# EAGLE board BPM (EAGLE 8.1.0)
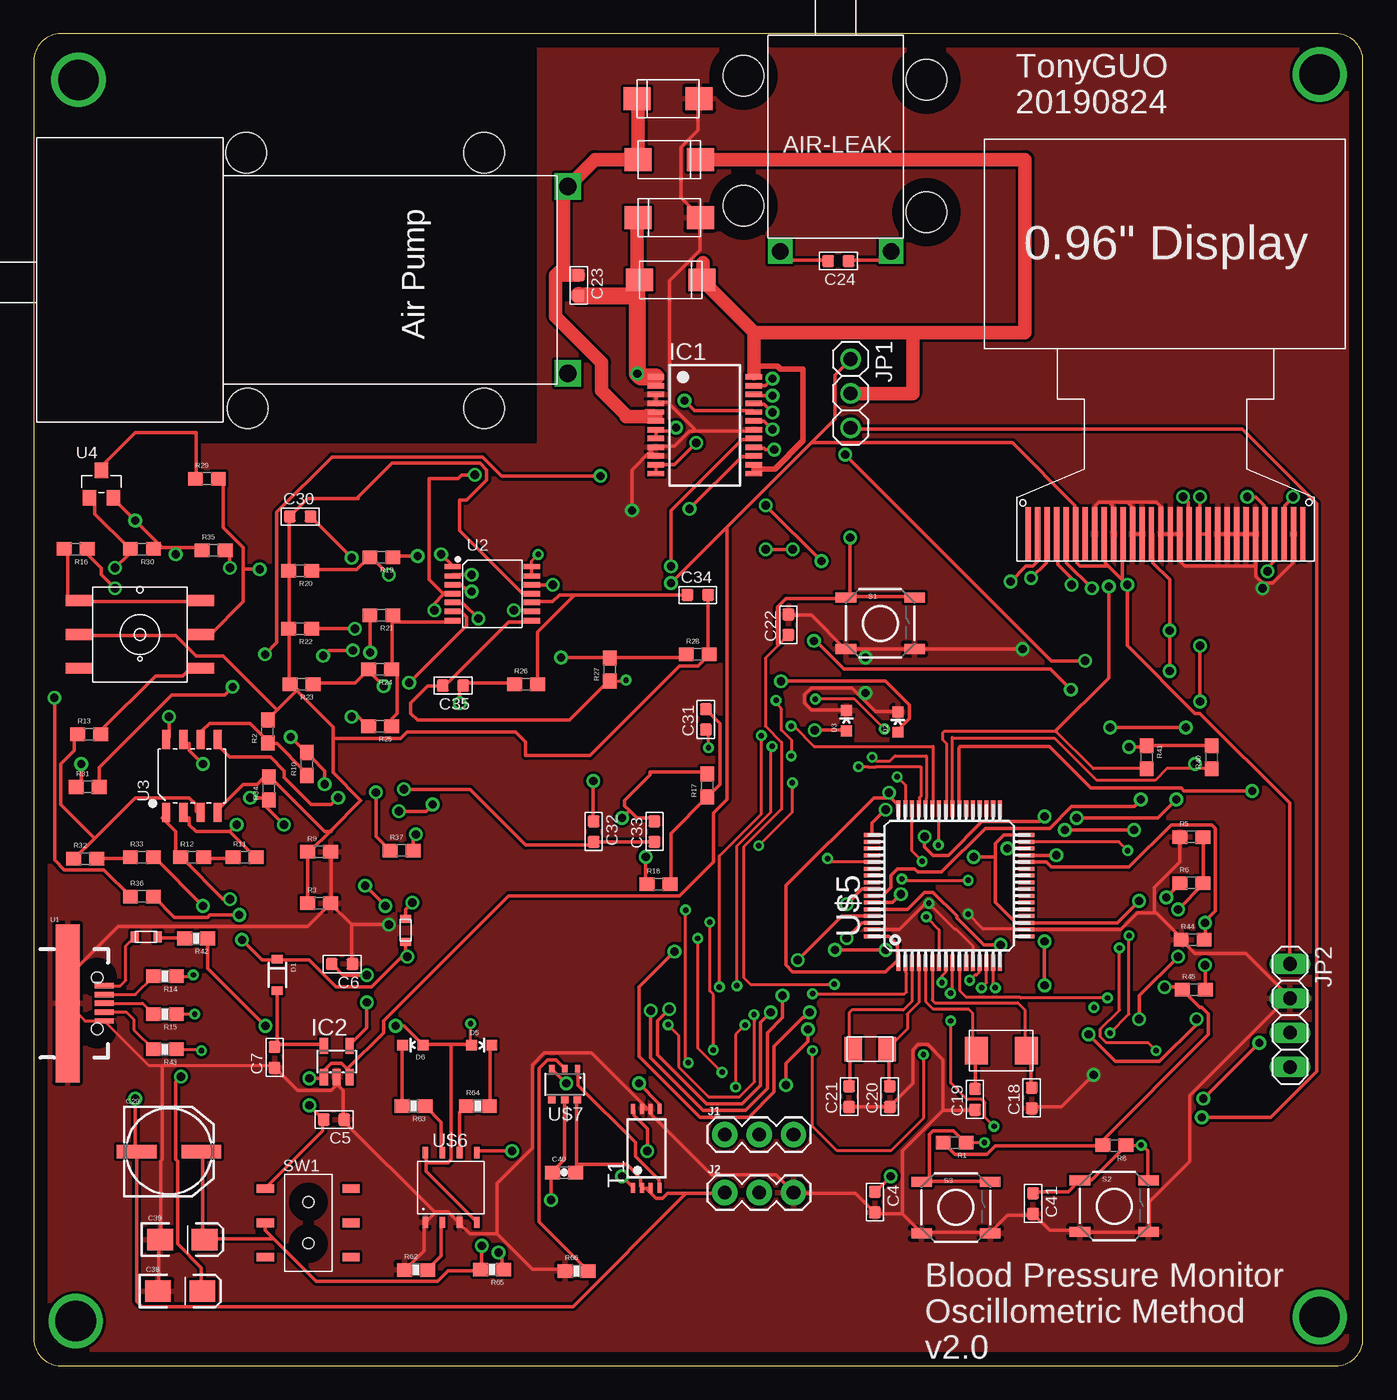
[diagram p5: board, top side]
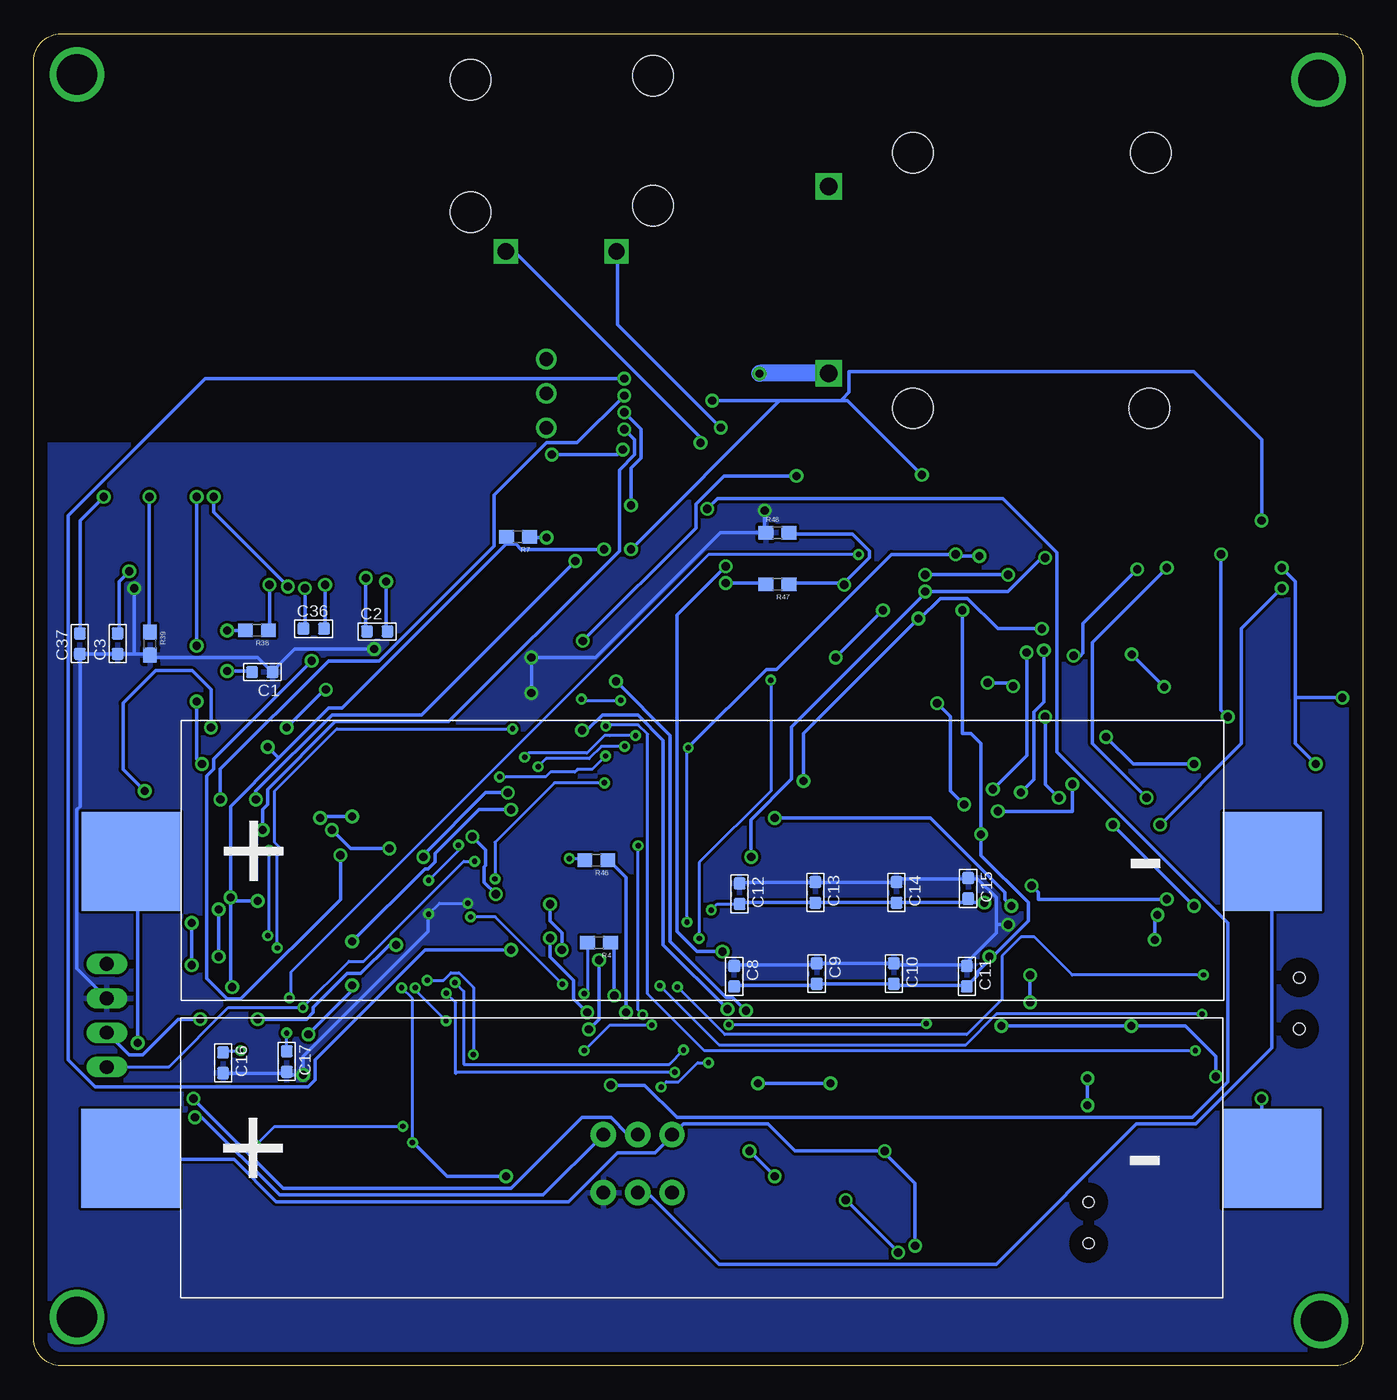
[diagram p6: board, bottom side, seen from below]

Size 98.3 x 98.5 mm. Coordinates in mm from the lower left corner, seen from the top.
Outline: 0,96.5 0,2 arc90 2,0 96.3,0 arc90 98.3,2 98.3,96.5 arc90 96.3,98.5 2,98.5 arc90 0,96.5
Copper layers (1*16): Top 0.035mm / dielectric 1.5mm / Bottom 0.035mm
Design rules "default": minimum track width 10mil, minimum drill 24mil, track to track 8mil, track to pad 8mil, pad to pad 8mil, via to via 8mil, smd to smd 8mil, copper to edge 40mil, drill to drill 8mil, minimum pad ring 10mil, minimum via ring 8mil, stop-mask expansion 4mil, vias tented up to drill 0mil, thermal gap 10mil

## Footprints (pad centres in the part's own frame; a part is rotated, then mirrored left to right if it is on the bottom)
C0603 = smd 0.889 x 0.889: 1 0,0.762; 2 0,-0.762
NIPPON_F80 = smd 2.95 x 1: + 2.4,0; - -2.4,0
EIA3216-KIT = smd 1.9 x 1.6: A 1.65,0; C -1.65,0
0603-CAP = smd 1.1 x 1: 1 -0.85,0; 2 0.85,0
SOD-323 = smd 0.63 x 0.83: 1 -1.15,0; 2 1.15,0
LED-0603 = smd 0.8 x 0.8: A 0,-0.75; C 0,0.75
SSOP24 = smd 0.4 x 1.25: 1 -3.575,-3.625; 2 -2.925,-3.625; 3 -2.275,-3.625; 4 -1.625,-3.625; 5 -0.975,-3.625; 6 -0.325,-3.625; 7 0.325,-3.625; 8 0.975,-3.625; 9 1.625,-3.625; 10 2.275,-3.625; 11 2.925,-3.625; 12 3.575,-3.625; 13 3.575,3.625; 14 2.925,3.625; 15 2.275,3.625; 16 1.625,3.625; 17 0.975,3.625; 18 0.325,3.625; 19 -0.325,3.625; 20 -0.975,3.625; 21 -1.625,3.625; 22 -2.275,3.625; 23 -2.925,3.625; 24 -3.575,3.625
SOT23-5L = smd 0.6 x 1.2: 1 -0.95,-1.15; 2 0,-1.15; 3 0.95,-1.15; 4 0.95,1.15; 5 -0.95,1.15
1X03 = drill 1.016 pad 1.88: 1 0,0; 2 2.54,0; 3 5.08,0
1X03' = drill 1.016: 1 -2.54,0; 2 0,0; 3 2.54,0
1X04 = drill 1.016 long: 1 -3.81,0; 2 -1.27,0; 3 1.27,0; 4 3.81,0
0603 = smd 1.1 x 1: 1 -0.85,0; 2 0.85,0
0603-RES = smd 1.1 x 1: 1 -0.85,0; 2 0.85,0
TACTILE_SWITCH_SMD = smd 1.524 x 0.762: 1 -2.54,1.905; 2 2.54,1.905; 3 -2.54,-1.905; 4 2.54,-1.905
SW6-2.54-SMD-7.0X3.5X1.5MM = smd 1.27 x 0.635: CH1A -3.175,2.54; CH1B -3.175,-2.54; CH2A 3.175,2.54; CH2B 3.175,-2.54; COM1 -3.175,0; COM2 3.175,0 | hole 0.813: 0,1.524; 0,-1.524
TSSOP-8 = smd 0.3 x 0.75: 1 -0.975,-2.925; 2 -0.325,-2.925; 3 0.325,-2.925; 4 0.975,-2.925; 5 0.975,2.925; 6 0.325,2.925; 7 -0.325,2.925; 8 -0.975,2.925
USB-MICRO-SMD = smd 1.4 x 0.4: D+1 2.7,0; D-1 2.7,0.65; GND1 2.7,-1.3; ID1 2.7,-0.65; VBUS1 2.7,1.3 | smd 1.778 x 11.684: GND 0,0 | hole 0.85: 2.2,1.9; 2.2,-1.9
TSSOP14-0.65-5X4.4MM = smd 0.4 x 1.2: 1 -2,-2.925; 2 -1.3,-2.925; 3 -0.65,-2.925; 4 0,-2.925; 5 0.65,-2.925; 6 1.3,-2.925; 7 2,-2.925; 8 2,2.925; 9 1.3,2.925; 10 0.65,2.925; 11 0,2.925; 12 -0.65,2.925; 13 -1.3,2.925; 14 -2,2.925
SOIC8-1.27-5X4MM = smd 0.6 x 1.4: 1 -1.905,-2.7; 2 -0.635,-2.7; 3 0.635,-2.7; 4 1.905,-2.7; 5 1.905,2.7; 6 0.635,2.7; 7 -0.635,2.7; 8 -1.905,2.7
SOT-23 = smd 1.016 x 1.143: 1 -0.889,-1.016; 2 0.889,-1.016; 3 0,1.016
MPS-3117-006G = smd 2 x 0.8: 1 8,6; 2 8,3.5; 3 8,1; 4 -1,1; 5 -1,3.5; 6 -1,6
18650SMD = smd 7.3 x 7.3: B+ -3.7,10.3; B- 80.7,10.3
TQFP64 = smd 1.2 x 0.3: 1 -5.7,3.75; 2 -5.7,3.25; 3 -5.7,2.75; 4 -5.7,2.25; 5 -5.7,1.75; 6 -5.7,1.25; 7 -5.7,0.75; 8 -5.7,0.25; 9 -5.7,-0.25; 10 -5.7,-0.75; 11 -5.7,-1.25; 12 -5.7,-1.75; 13 -5.7,-2.25; 14 -5.7,-2.75; 15 -5.7,-3.25; 16 -5.7,-3.75; 33 5.7,-3.75; 34 5.7,-3.25; 35 5.7,-2.75; 36 5.7,-2.25; 37 5.7,-1.75; 38 5.7,-1.25; 39 5.7,-0.75; 40 5.7,-0.25; 41 5.7,0.25; 42 5.7,0.75; 43 5.7,1.25; 44 5.7,1.75; 45 5.7,2.25; 46 5.7,2.75; 47 5.7,3.25; 48 5.7,3.75 | smd 0.3 x 1.2: 17 -3.75,-5.7; 18 -3.25,-5.7; 19 -2.75,-5.7; 20 -2.25,-5.7; 21 -1.75,-5.7; 22 -1.25,-5.7; 23 -0.75,-5.7; 24 -0.25,-5.7; 25 0.25,-5.7; 26 0.75,-5.7; 27 1.25,-5.7; 28 1.75,-5.7; 29 2.25,-5.7; 30 2.75,-5.7; 31 3.25,-5.7; 32 3.75,-5.7; 49 3.75,5.7; 50 3.25,5.7; 51 2.75,5.7; 52 2.25,5.7; 53 1.75,5.7; 54 1.25,5.7; 55 0.75,5.7; 56 0.25,5.7; 57 -0.25,5.7; 58 -0.75,5.7; 59 -1.25,5.7; 60 -1.75,5.7; 61 -2.25,5.7; 62 -2.75,5.7; 63 -3.25,5.7; 64 -3.75,5.7
SOT23-8 = smd 0.42 x 0.835: 1 -1.905,-2.58; 2 -0.635,-2.58; 3 0.635,-2.58; 4 1.905,-2.58; 5 1.905,2.58; 6 0.635,2.58; 7 -0.635,2.58; 8 -1.905,2.58
SOT23-6 = smd 0.4 x 0.55: 1 -0.95,-1.15; 2 0,-1.15; 3 0.95,-1.15 | smd 0.55 x 0.55: 4 0.95,1.15; 5 0,1.15; 6 -0.95,1.15
32.768KHZ-FC-135 = smd 1.3 x 1.8: 1 0,0; 2 2.5,0
NX5032CA-8MHZ = smd 1.7 x 2: 1 0,0; 2 3.7,0
FCM1608KF-601T03 = smd 0.6 x 0.8: 1 -0.05,0.4; 2 1.65,0.4
AIR-LEAK = drill 1.2 pad 1.778 square: 1 0.9,-1; 2 9.1,-1 | hole 3: -1.8,12; 11.7,11.7; -1.8,2.4; 11.7,1.9
DQB030-AIRPUMP = drill 1.3 pad 1.778 square: 1 0.8,-0.8; 2 14.6,-0.8 | hole 3: 17.1,23; -1.8,22.9; -1.8,5.4; 17.1,5.4
SMA-SS34 = smd 2 x 1.7: 1 0,-1.4; 2 4.6,-1.4
ER-OLED0.96 = smd 0.4 x 4: P$1 0.85,2; P$2 1.55,2; P$3 2.25,2; P$4 2.95,2; P$5 3.65,2; P$6 4.35,2; P$7 5.05,2; P$8 5.75,2; P$9 6.45,2; P$10 7.15,2; P$11 7.85,2; P$12 8.55,2; P$13 9.25,2; P$14 9.95,2; P$15 10.65,2; P$16 11.35,2; P$17 12.05,2; P$18 12.75,2; P$19 13.45,2; P$20 14.15,2; P$21 14.85,2; P$22 15.55,2; P$23 16.25,2; P$24 16.95,2; P$25 17.65,2; P$26 18.35,2; P$27 19.05,2; P$28 19.75,2; P$29 20.45,2; P$30 21.15,2

## Placement (x,y rotation side)
C1  0.1uf  [C0603]  81.4,51.3 270 bottom
C2  1uf  [C0603]  72.9,54.3 90 bottom
C3  4.7uf  [C0603]  92.1,53.4 180 bottom
C4  0.1uf  [C0603]  62.2,12.1 0 top
C5  0.1uf  [C0603]  22.2,18.2 270 top
C6  0.1uf  [C0603]  22.8,29.7 270 top
C7  0.1uf  [C0603]  17.8,22.8 180 top
C8  0.1uf  [C0603]  46.5,28.8 0 bottom
C9  0.1uf  [C0603]  40.4,29 0 bottom
C10  1uf  [C0603]  34.7,29 0 bottom
C11  1uf  [C0603]  29.3,28.8 0 bottom
C12  0.1uf  [C0603]  46.1,34.9 0 bottom
C13  0.1uf  [C0603]  40.5,35 0 bottom
C14  0.1uf  [C0603]  34.5,35 0 bottom
C15  0.1uf  [C0603]  29.2,35.3 0 bottom
C16  2.2uf  [C0603]  84.3,22.4 0 bottom
C17  2.2uf  [C0603]  79.6,22.5 0 bottom
C18  22pF  [C0603]  73.8,19.8 180 top
C19  22pF  [C0603]  69.6,19.7 180 top
C20  12.5pF  [C0603]  63.3,19.9 180 top
C21  12.5pF  [C0603]  60.3,19.9 180 top
C22  0.1uf  [C0603]  55.8,54.8 180 top
C23  0.1uf  [C0603]  40.3,79.9 0 top
C24  0.1uf  [C0603]  59.5,81.7 270 top
C29  100uF  [NIPPON_F80]  10,15.84 0 top
C30  1uF  [C0603]  19.7,62.8 90 top
C31  1uF  [C0603]  49.7,47.8 180 top
C32  1uF  [C0603]  41.4,39.5 0 top
C33  1uF  [C0603]  45.9,39.5 180 top
C34  0.1uF  [C0603]  49.1,57 90 top
C35  0.1uF  [C0603]  31,50.3 270 top
C36  1uf  [C0603]  77.6,54.5 90 bottom
C37  1uf  [C0603]  94.9,53.4 180 bottom
C38  10uF/10v  [EIA3216-KIT]  10.83,5.52 0 top
C39  10uF/10v  [EIA3216-KIT]  10.99,9.32 0 top
C40  0.1uF  [0603-CAP]  39.21,14.29 0 top
C41  0.1uf  [C0603]  73.9,12 0 top
D1  BAT20JFILM  [SOD-323]  18,28.9 270 top
D2  BLUE  [LED-0603]  63.9,47.6 0 top
D3  BLUE  [LED-0603]  60.1,47.7 0 top
D5  BLUE  [LED-0603]  33.12,23.71 270 top
D6  BLUE  [LED-0603]  28.03,23.71 90 top
IC1  TB6612FNG  [SSOP24]  49.62,69.55 270 top
IC2  LD398530RM  [SOT23-5L]  22.4,22.5 0 top
J1  455-1750-1-ND  [1X03]  51.1,17.1 0 top
J2  455-1750-1-ND  [1X03]  51.1,12.8 0 top
JP1  [1X03']  60.4,71.9 270 top
JP2  [1X04]  92.9,25.9 270 top
R1  10k  [0603]  68.1,16.5 180 top
R2  1k  [0603]  17.3,46.9 90 top
R3  0R  [0603]  21.1,34.2 0 top
R4  1k  [0603]  56.5,31.3 180 bottom
R5  10k  [0603]  85.6,39.1 0 top
R6  10k(N.M)  [0603]  85.6,35.7 0 top
R7  10k  [0603]  62.5,61.3 180 bottom
R8  10k  [0603]  79.9,16.3 180 top
R9  0R  [0603]  21.1,38 0 top
R10  10k  [0603]  20.2,44.5 90 top
R11  680k  [0603]  15.6,37.6 0 top
R12  0R  [0603]  11.7,37.6 0 top
R13  30k  [0603]  4.1,46.7 0 top
R14  22R  [0603-RES]  9.7,28.8 180 top
R15  22R  [0603-RES]  9.7,26 180 top
R16  30k  [0603]  3.1,60.4 180 top
R17  220k  [0603]  49.8,42.9 90 top
R18  220k  [0603]  46.2,35.6 0 top
R19  1M  [0603]  25.7,59.8 180 top
R20  1M  [0603]  19.7,58.8 180 top
R21  220k  [0603]  25.7,55.5 180 top
R22  220k  [0603]  19.7,54.5 180 top
R23  1M  [0603]  19.8,50.4 180 top
R24  1M  [0603]  25.6,51.5 180 top
R25  39k  [0603]  25.6,47.3 180 top
R26  39k  [0603]  36.4,50.4 0 top
R27  1M  [0603]  42.6,51.5 90 top
R28  1M  [0603]  49.1,52.6 0 top
R29  1.2k(N.M)  [0603]  12.8,65.6 0 top
R30  4.7k(N.M)  [0603]  8,60.4 180 top
R31  4.7k  [0603]  4,42.8 0 top
R32  680k  [0603]  3.8,37.5 0 top
R33  0R  [0603]  8,37.6 0 top
R34  0R  [0603]  17.4,42.7 90 top
R35  200k(N.M)  [0603]  13.3,60.3 0 top
R36  4.7k(N.M)  [0603]  8,34.7 0 top
R37  0  [0603]  27.2,38.1 0 top
R38  10k  [0603]  81.8,54.4 180 bottom
R39  390k  [0603]  89.7,53.4 270 bottom
R40  4.7k  [0603]  87.1,45 90 top
R41  4.7k  [0603]  82.3,45 270 top
R42  0  [0603-RES]  12,31.6 180 top
R43  0  [0603-RES]  9.7,23.4 180 top
R44  10k  [0603]  85.7,31.5 0 top
R45  10k(N.M)  [0603]  85.8,27.8 0 top
R46  1k  [0603]  56.7,37.4 180 bottom
R47  1.6M  [0603]  43.3,57.8 180 bottom
R48  4.3M  [0603]  43.3,61.6 0 bottom
R62  2K  [0603-RES]  28.26,7.09 0 top
R63  1K  [0603-RES]  28.09,19.21 180 top
R64  1K  [0603-RES]  32.84,19.21 0 top
R65  100R  [0603-RES]  33.89,7.11 180 top
R66  1K  [0603-RES]  40.14,7.01 0 top
S1  [TACTILE_SWITCH_SMD]  62.6,54.9 0 top
S2  [TACTILE_SWITCH_SMD]  79.9,11.8 0 top
S3  [TACTILE_SWITCH_SMD]  68.2,11.7 0 top
SW1  [SW6-2.54-SMD-7.0X3.5X1.5MM]  20.3,10.57 0 top
T1  DMN3024LSD  [TSSOP-8]  45.3,16.07 0 top
U1  [USB-MICRO-SMD]  2.5,26.8 0 top
U2  LM324PW-TSSOP14  [TSSOP14-0.65-5X4.4MM]  33.9,57.1 270 top
U3  LM358DR-SOIC8  [SOIC8-1.27-5X4MM]  11.7,43.6 0 top
U4  (N.M)  [SOT-23]  5,65.2 0 top
U$1  MPS-3117-006G  [MPS-3117-006G]  4.35,50.58 0 top
U$4  18650SMD  [18650SMD]  87.45,5.04 0 bottom
U$5  STM32F405R  [TQFP64]  67.7,35.5 90 top
U$6  TP4056  [SOT23-8]  30.85,13.18 0 top
U$7  DW01  [SOT23-6]  39.26,20.81 180 top
U$8  32.768KHZ-FC-135  [32.768KHZ-FC-135]  60.6,23.4 0 top
U$9  NX5032CA-8MHZ  [NX5032CA-8MHZ]  69.7,23.3 0 top
U$10  FCM1608KF-601T03  [FCM1608KF-601T03]  27.9,31.4 90 top
U$11  AIR-LEAK  [AIR-LEAK]  54.3,83.4 0 top
U$12  DQB030-AIRPUMP  [DQB030-AIRPUMP]  38.7,72.6 90 top
U$13  SMA-SS34  [SMA-SS34]  44.8,81.7 0 top
U$14  SMA-SS34  [SMA-SS34]  49.3,83.5 180 top
U$15  FCM1608KF-601T03  [FCM1608KF-601T03]  7.5,31.3 0 top
U$16  SMA-SS34  [SMA-SS34]  44.7,90.6 0 top
U$17  SMA-SS34  [SMA-SS34]  49.2,92.3 180 top
U$18  ER-OLED0.96  [ER-OLED0.96]  72.7,59.5 0 top
U$19  18650SMD  [18650SMD]  87.4,27 0 bottom

## Tracks (layer width: path | path; a pad name or v marks a point on that pad's centre or on a via)
+OUTPUT
  Top 0.254: R13.2 5,47 9,51 11,51 11.5,51.5 12,51.5 U$1.3
-OUTPUT
  Top 0.254: R16.2 2.5,60 2.5,56.5 3,56.5 U$1.6 3.5,56.5 12,56.5 U$1.1
AC  (via drill 0.4 pad 0.1)
  Top 0.204: R27.1 43.75,50.65 v43.8,50.7 | v49.1,31.6 49.1,23.5 v50.9,21.7 | v67.79,27.55 67.95,27.7 U$5.9
  Top 0.254: U2.8 36.75,55 35.12,55 30.5,50.38 30.25,50.38 C35.2 30.12,50.25 29.12,50.25 27.88,49 27.88,48.25 28.38,47.75 39.62,47.75 42.5,50.62 R27.1
  Bottom 0.204: v43.8,50.7 43.8,42.5 49.1,37.2 v49.1,31.6 | v50.9,21.7 67,21.7 67.1,21.6 67.1,26.86 v67.79,27.55
AGND
  Top 0.254: C34.2 49.88,57 49.88,52.62 R28.2 49.88,52.5 49.12,51.75 47.75,51.75 41.12,45.12 36.38,45.12 36.38,46.12 35.62,46.88 27.62,46.88 27.12,46.38 22.12,46.38 | R3.1 R9.1 20.38,38 21.94,39.56 | 21.94,39.56 24.19,41.81 22.12,43.88 22.12,46.38 | U2.11 36.75,57.12 36.12,57.12 31.5,61.75 31.5,64 32,64 33.5,65.5 33.5,66.25 33,66.75 26.5,66.75 24,64.25 24,64.12 20.25,64.12 19,62.88 C30.1 18.88,62.75 18.88,58.88 R20.2 18.88,58.75 18.88,54.62 R22.2 | R22.2 18.88,54.5 18.88,50.5 R23.2 19,50.38 19.44,49.94 | 18.75,54.12 R22.2 | 22.12,46.38 22.12,47.25 19.44,49.94 | U3.4 13.5,41 15.5,43 16.5,43 17,43.5 R34.2 17.5,43.5 21.5,39.5 22,39.5 21.94,39.56 | 19.44,49.94 18,48.5 | 18,48.5 17.5,48 R2.2 | 19.5,50 19.44,49.94 | 18,48.5 14,52.5 12,52.5 10.5,54 3.5,54 U$1.5
AIN1  (via drill 0.61)
  Top 0.254: U$5.58 62.75,34.75 63.38,35.38 63.38,36.25 63.88,36.75 65.12,36.75 65.38,36.5 67.12,36.5 70.38,39.75 75.12,39.75 76.75,41.38 81.38,41.38 v81.88,41.88 | v54.12,63.62 v58.25,59.5 | v54.62,70.5 54,71.12 53.25,71.12 IC1.21
  Bottom 0.254: v81.88,41.88 81.88,42.5 76.25,48.12 69.62,48.12 v58.25,59.5 | v54.12,63.62 54.12,66.38 53.38,67.12 53.38,69.25 v54.62,70.5
AIN2  (via drill 0.61)
  Top 0.254: U$5.59 63.5,34.25 v64.12,34.88 | v65.88,39.12 65.88,38.38 66.5,37.75 67.62,37.75 70.12,40.25 74.38,40.25 v74.75,40.62 | v77.12,40.5 83.12,40.5 v84.5,41.88 | v54.62,71.75 53.25,71.75 IC1.22
  Bottom 0.254: v64.12,34.88 65,35.75 65,36.88 64.88,37 64.88,38.12 v65.88,39.12 | v74.75,40.62 77,40.62 v77.12,40.5 | v84.5,41.88 84.5,44.12 76.5,52.12 72.75,52.12 64.25,60.62 64.25,64.38 60.38,68.25 58.12,68.25 v54.62,71.75
B1  (via drill 0.4 pad 0.1)
  Top 0.204: R8.1 v81.9,16.3 | v67.81,25.5 67.81,20.9 69.02,19.69 70.11,19.69 70.35,19.44 70.35,18.36 v71.01,17.7 | v70.09,27.95 70.45,28.31 U$5.14
  Top 0.254: S2.2 82.38,13.75 82.38,15.88 82,16.25 v81.9,16.3 | C41.1 74,12.88 76.5,12.88 77.25,13.62 S2.1 77.38,13.75 78.25,13.75 80.75,16.25 R8.1
  Bottom 0.204: v81.9,16.3 80.5,17.7 v71.01,17.7 | v67.81,25.5 70.09,27.78 v70.09,27.95
B2  (via drill 0.4 pad 0.1, 0.61)
  Top 0.204: R1.1 v70.3,16.5 | v71.1,27.95 70.95,28.1 U$5.15
  Top 0.254: S3.2 70.62,13.62 65.75,13.62 S3.1 66.25,13.75 66.25,17.12 66.5,17.38 68,17.38 68.88,16.5 R1.1 | v63.38,14 62.25,12.88 C4.1
  Bottom 0.204: v70.3,16.5 70.3,27.15 v71.1,27.95
  Bottom 0.254: v63.38,14 67.75,14 70.25,16.5 v70.3,16.5
BAT  (via drill 0.4 pad 0.1)
  Top 0.204: U2.14 U2.13 36.83,59.52 v37.3,60 | v79.4,27.2 72.98,27.2 72.93,27.25 68.95,27.25 68.5,27.7 68.5,29.07 68.5,29.75 U$5.10
  Bottom 0.204: v37.3,60 48.4,60 79.3,29.1 79.3,27.3 v79.4,27.2
BAT+  (via drill 0.61)
  Top 0.254: 17.69,9.44 17.12,10 SW1.COM1 | 17.69,9.44 20.88,6.25 29.88,6.25 30.62,7 33,7 R65.2 33.12,7.12 v33.12,8.88 | 17.69,9.44 17.62,9.38 12.75,9.38 C39.A 12.75,9.5 12.5,9.75 12.5,15.75 C29.+ | v35.38,15.88 32.88,15.88 U$6.5
  Bottom 0.254: U$4.B+ 91.12,15.25 83.5,15.25 80.38,12.12 58.75,12.12 55.12,15.75 52.38,15.75 51.12,17 J1.1 51,17.12 50.25,17.88 44,17.88 42,15.88 v35.38,15.88 35.38,15.75 33.12,13.5 v33.12,8.88
BAT-  (via drill 0.61)
  Top 0.254: v7.5,19.75 7.5,15.88 C29.- 7.62,15.75 7.62,4.75 8,4.38 39.88,4.38 48.12,12.62 48.12,12.75 | 45.38,13.12 45.62,13.12 T1.3 | 45.38,13.12 45,13.12 T1.2 44.88,13.25 44.88,13.88 43.88,14.88 40.12,14.88 | 40.12,14.88 40.12,14.38 C40.2 | 40.12,14.88 40.12,19.62 U$7.6 | 48.12,12.75 46.88,12.75 46.5,12.38 46,12.38 45.38,13 45.38,13.12 | 48.12,12.75 51,12.75 J2.1
  Bottom 0.254: v7.5,19.75 7.5,16.12 6.75,15.38 U$4.B-
BIN1  (via drill 0.61)
  Top 0.254: U$5.62 61.25,32.75 v60.12,31.62 | v57.38,26.12 57,25.75 56.88,25.75 54.75,23.62 54.75,20.25 52.88,18.38 49.25,18.38 44.75,22.88 44.75,28 v47.38,30.62 | v47.12,59.12 47.12,63.25 52.38,68.5 53.12,68.5 IC1.17
  Bottom 0.254: v60.12,31.62 60.12,30.25 58.38,28.5 58.38,27.12 v57.38,26.12 | v47.38,30.62 49.25,30.62 50.75,32.12 50.75,55.5 v47.12,59.12
BIN2  (via drill 0.61)
  Top 0.254: v75.62,37.75 U$5.29 | v77.75,52.12 75.25,52.12 v60,67.38 | v54.75,67.75 54.12,67.75 54,67.88 53.25,67.88 IC1.16
  Bottom 0.254: v75.62,37.75 75.62,34.5 83,27.12 84,27.12 85.5,28.62 85.5,43.62 85,44.12 85,44.88 v77.75,52.12 | v60,67.38 55.12,67.38 v54.75,67.75
BOOT0  (via drill 0.61)
  Top 0.254: R5.2 86.5,39 86.5,35.75 R6.2 86.5,35.62 v84.62,33.75 | U$5.60 64.62,33.75 65.88,35 66.5,35 68.25,33.25 68.25,33.12 70.25,31.12 v71.5,31.12 | v81.75,25.62 81.75,27.38 v84.62,30.25
  Bottom 0.254: v71.5,31.12 72,31.12 74.12,29 75.12,29 77.62,26.5 77.62,26.12 78.12,25.62 v81.75,25.62 | v84.62,33.75 v84.62,30.25
BOOT1  (via drill 0.61)
  Top 0.254: v86.62,29.62 86.62,27.88 R45.2 | R44.2 86.62,31.5 v86.62,32.75 86.62,32.88 87.38,33.62 87.38,39.75 87.12,40 84.12,40 81,36.88 75.25,36.88 74.88,37.25 U$5.28
  Bottom 0.254: v86.62,32.75 v86.62,29.62
DC  (via drill 0.4 pad 0.1, 0.61)
  Top 0.204: U$5.8 67.41,29.75 67.41,29.07 67.16,28.83 v67.16,28.34 | v50.25,23.35 50.25,27.45 49.99,27.71 v49.99,32.8 | v49.9,45.7 49.9,46.84 C31.1
  Top 0.254: v28.38,59.88 26.62,59.88 R19.1 | v30.12,60 31,59.12 U2.1
  Bottom 0.204: v67.16,28.34 66.5,27.68 66.5,22.3 51.3,22.3 v50.25,23.35 | v49.99,32.8 49.99,45.61 v49.9,45.7
  Bottom 0.254: v28.38,59.88 30,59.88 v30.12,60 34.88,60 43.38,51.5 44.12,51.5 49.88,45.75 v49.9,45.7
EXT_BAT  (via drill 0.61)
  Top 0.254: v86.38,18.38 91.5,18.38 94.88,21.75 94.88,63.75 89.38,69.25 60.5,69.25 JP1.3
  Bottom 0.254: v86.38,18.38 85.88,18.38 80.12,12.62 60.62,12.62 56.25,17 J1.3
GND  (via drill 0.4 pad 0.1, 0.61)
  Top 0.204: U1.GND 3.8,25.5 U1.GND1 8.5,22.2 9.5,22.2 17.64,22.2 C7.1 | U$5.18 73.36,32.3 72.67,32.3 70.2,32.3 v69.1,33.4 | v66.2,34.2 68.1,32.3 68.2,32.3 69.45,31.05 U$5.12
  Top 0.254: R62.1 27.5,7.12 28.88,8.5 28.88,10.5 U$6.1 29,10.62 29.75,11.38 | 29.75,11.38 30.62,11.38 31.38,10.62 U$6.3 31.5,10.5 32.25,9.75 34.25,9.75 | 34.25,9.75 36.88,7.12 39.25,7.12 R66.1 | 23.5,32.62 23.5,29.75 C6.1 | 23.5,32.62 22,34.12 R3.2 | R9.2 22,38 22,34.25 R3.2 | C38.C 9.25,5.62 9.25,9.25 C39.C 9.38,9.38 9.38,15.12 9.5,15.25 9.5,22.2 | 22.5,20.75 22.88,20.38 22.88,18.25 C5.1 22.88,18.12 29.62,11.38 29.75,11.38 | 22.5,20.75 22.5,21.25 IC2.2 | 22.5,20.75 22.38,20.75 22,20.38 19.5,20.38 17.88,22 C7.1 | R3.2 20.25,32.5 6.25,32.5 2.5,28.75 U1.GND | 23.5,32.62 v26.25,32.62 | 61.19,49.44 60.5,50.12 57.5,50.12 57,49.62 57,49 57.5,48.5 60,48.5 D3.C | 61.19,49.44 62.25,48.38 63.88,48.38 D2.C | C22.2 55.88,55.5 57.5,55.5 60,53 S1.3 60.12,53 61.5,53 | 61.5,53 65.12,53 S1.4 65.25,53 v73.12,53 | v61.5,49.75 61.19,49.44 | 61.5,53 v61.5,52.38 | U$17.1 49.12,93.62 49.12,91.38 47.88,90.12 47.88,86.38 49.25,85 U$14.1 49.25,84.88 49.25,82.5 47,80.25 47,71.25 46.88,71.25 | IC1.3 46,71.75 46,71.25 IC1.4 46.12,71.25 46.88,71.25 | v44.25,63.25 44.25,66.25 45.62,67.62 | 45.62,67.62 45.88,67.88 IC1.9 46,68 47.38,68 48.5,69.12 48.88,69.12 | 45.62,67.62 45.88,67.38 IC1.10 | 48.88,69.12 53.12,69.12 IC1.18 | 46.88,71.25 48.88,69.25 48.88,69.12 | 45.25,19 T1.6 45.62,18.62 50.12,14.12 54.88,14.12 56.12,12.88 J2.3 56.25,12.75 60.75,12.75 62.12,11.38 C4.2 62.25,11.25 64.25,11.25 | 45.25,19 45,19 T1.7 | C21.1 60.38,19.12 63.25,19.12 C20.1 63.38,19.25 65,20.88 65,23.38 65.38,23.75 66.12,23.75 67.25,22.62 67.25,18.88 | 64.25,11.25 65.62,9.88 S3.3 65.75,9.88 70.62,9.88 S3.4 70.75,9.88 72,11.12 73.88,11.12 C41.2 74,11.12 75.12,10 77.25,10 S2.3 77.38,9.88 82.38,9.88 S2.4 82.5,10 82.5,12.12 85.5,15.12 85.5,20 92.75,27.25 JP2.2 92.88,27.25 89.62,30.5 85.88,30.5 84.88,31.5 R44.1 84.88,31.62 82.88,33.62
  Top 0.254: 67.25,18.88 69.5,18.88 C19.1 | 67.25,18.88 64.25,15.88 64.25,11.25 | U$18.P$13 U$18.P$12 81.25,63.5 80.94,63.81 | 79.5,63.88 78.75,63.88 78.5,63.62 78.5,61.5 U$18.P$8 | 79.5,63.88 79.75,63.62 79.75,61.5 U$18.P$10 | 80.94,63.81 80.88,63.88 79.5,63.88 | 80.94,63.81 81,63.88 83,63.88 83.38,63.5 83.38,61.62 U$18.P$15 U$18.P$16 U$18.P$17 84.75,59.5 85.12,59.12 90.38,59.12 | U$18.P$21 U$18.P$22 U$18.P$23 U$18.P$24 U$18.P$25 90.38,61.38 90.38,59.12 | 90.88,57.88 91.62,57.88 93.12,59.38 93.12,61.5 U$18.P$29 | 90.88,57.88 90.38,58.38 90.38,59.12 | 90.88,57.88 v90.88,57.5 | v78.38,21.5 76,19.12 73.88,19.12 C18.1 | U$5.63 64,32.25 65.88,34.12 66.12,34.12 v66.2,34.2 | R5.1 84.75,37.25 82.88,35.38 82.88,33.62 | U$5.18 80.38,32.25 81.62,33.5 82.88,33.5 82.88,33.62 | 34.25,9.75 34.25,13.5 36.88,16.12 36.88,22.25 37.75,23.12 41.25,23.12 45.25,19.12 45.25,19
  Bottom 0.204: v69.1,33.4 68.3,34.2 v66.2,34.2
  Bottom 0.254: C12.1 46,35.75 C13.1 40.38,35.75 34.62,35.75 C14.1 34.5,35.88 34.38,36 29.25,36 C15.1 29.12,36 28.5,36 27.12,34.62 27.12,32.62 | C8.1 46.5,29.62 40.38,29.62 C9.1 40.38,29.75 34.75,29.75 C10.1 34.62,29.75 34.5,29.62 29.38,29.62 C11.1 29.38,29.75 27.12,32 27.12,32.62 | v26.25,32.62 27.12,32.62 | v61.5,49.75 v61.5,52.38 56.75,52.38 47.5,61.62 44.38,61.62 R48.1 44.25,61.62 v44.25,63.25 | 90.88,52.62 89.75,52.62 R39.2 89.62,52.5 89.5,52.38 81.75,52.38 80.75,51.38 C1.1 80.62,51.38 79,53 v73.12,53 | 90.88,52.62 92,52.62 C3.1 92.12,52.62 94.88,52.62 C37.1 94.88,52.5 94.88,41.38 95.12,41.12 95.12,29.38 93,27.25 JP2.2 | v90.88,57.5 90.88,52.62 | C16.2 84.25,21.62 79.62,21.62 C17.2 79.5,21.62 79.38,21.5 v78.38,21.5 78.38,22.88 69.12,32.12 69.12,33.38 v69.1,33.4
  pour Bottom: -2.8,68.1 102,68.1 102,-1.9 -2.8,-1.9
  pour Top: -2.8,68 102,68 102,-1.9 -2.8,-1.9
  pour Bottom: 36.5,101.6 101.1,101.6 101.1,61.2 36.5,61.2
  pour Top: 37.4,101 100.5,101 100.5,62.3 37.4,62.3
I2C3_SCL  (via drill 0.61)
  Top 0.204: R41.2 78.35,44.15 75.6,46.9 67.3,46.9 67.2,46.8 67.2,46.3 67.5,46 67.5,41.93 67.5,41.24 U$5.41
  Top 0.254: v85,64.25 85.38,63.88 85.38,61.5 U$18.P$18 | v79.5,57.62 79.5,50.88 75.62,47 75.6,46.9
  Bottom 0.254: v85,64.25 85,63.12 v79.5,57.62
I2C3_SDA  (via drill 0.61)
  Top 0.204: R40.1 85.88,44.15 83.78,44.15 82.93,43.3 78.61,43.3 75.5,46.4 68,46.4 67.91,46.49 67.91,41.24 U$5.40
  Top 0.254: U$18.P$20 U$18.P$19 86.25,61.62 v86.25,64.25 | v86.25,49.12 v86.25,53.25 | 85.88,44.15 v85.88,44.5
  Bottom 0.254: v86.25,53.25 v86.25,64.25 | v86.25,49.12 86.25,44.88 v85.88,44.5
L+  (via drill 0.61)
  Top 0.254: IC1.8 46,68.62 46,69.12 IC1.7 46.12,69.12 47.25,69.12 v47.5,69.38 | C24.2 58.62,81.75 55.88,81.75 55.25,82.38 U$11.1
  Bottom 0.254: v47.5,69.38 55.12,77 55.12,82.38 U$11.1
L-  (via drill 0.61)
  Top 0.254: IC1.12 46,66 IC1.11 47.38,66.62 v49,68.25 | U$11.2 62.75,81.75 60.38,81.75 C24.1
  Bottom 0.254: v49,68.25 49,68.62 62.75,82.38 63.38,82.38 U$11.2
LED1  (via drill 0.4 pad 0.1)
  Top 0.204: U$5.53 58.95,37.25 v58.7,37.5
  Bottom 0.204: v58.7,37.5 57.65,37.5 R46.2
LED2  (via drill 0.4 pad 0.1)
  Top 0.204: v57.6,27.5 64.4,27.5 64.54,27.64 64.54,29.03 64.5,29.07 64.5,29.75 U$5.2
  Bottom 0.204: R4.2 57.35,27.75 v57.6,27.5
M+  (via drill 0.61)
  Top 0.254: IC1.2 46,72.5 IC1.1 | 44.75,84.88 U$14.2 | U$13.1 44.75,80.38
  Top 1.016: U$14.2 44.62,84.83 44.62,78.9
  Top 1.27: IC1.1 44.88,73.12 v44.62,73.38 44.62,78.9 | 44.62,78.9 44.62,80.12 U$13.1 | C23.2 44.39,79.14 44.62,78.9
  Bottom 0.254: 39.5,73.38 U$12.1
  Bottom 1.27: U$12.1 44.6,73.4 v44.62,73.38
M-
  Top 0.254: 44.62,89.25 U$16.1 44.5,89.25 | 44.62,93.62 U$17.2 | IC1.6 46,70.2 46,70.5 IC1.5 45.88,70.62 45.25,70.62 | 40.25,80.75 C23.1 40.25,80.62
  Top 1.016: 46,70.2 43.8,70.2 43.8,70.3 42,72.1 42,74.2 38.6,77.6 38.6,80.64 39.16,81.2 | C23.1 39.16,80.66 39.16,81.2 | U$17.2 44.7,93.6 U$16.1 41.5,89.2 U$12.2 39.16,86.86 39.16,81.2
MCU_3V3  (via drill 0.6, 0.61)
  Top 0.254: U$5.64 63.25,31.75 63.88,31.12 63.88,29.88 | 63.88,29.88 U$5.1 | 63.25,42 62.12,42 55.62,35.5 55.62,29.62 56.12,29.12 63,29.12 63.75,29.88 63.88,29.88 | 63.25,42 63.38,42 63.88,41.5 63.88,41.25 U$5.48 | 71.12,37.62 71.12,38.62 71.75,39.25 U$5.32 | 71.12,37.62 71.12,34.25 72.62,32.75 U$5.19 80.12,32.75 v81.75,34.38 | R40.2 87,45.88 82.38,45.88 R41.1 82.25,45.75 v81,45.75 | R1.2 68.12,15.62 70.5,15.62 71.12,16.25 79,16.25 R8.2 78.75,16.38 86.88,24.5 86.88,26 86.38,26.5 86.25,26.5 R45.1 84.75,28 v83.62,28 | v83.75,34.62 84.75,35.62 R6.1 | v63.25,42.38 63.25,42 | 71.12,37.62 v69.5,37.62 | 30.25,57.12 30.88,57.12 U2.4 | 30.25,57.12 29.25,58.12 29.25,65.62 31.38,65.62 31.62,65.88 31.9,65.88 | v48.12,71.38 48.88,70.62 53.12,70.62 IC1.20 | 31.75,65.88 31.9,65.88 | 31.9,65.88 v32.62,65.88 | 18,30 20.38,30 22.38,28 25,28 27.44,30.44 | 27.44,30.44 27.5,30.5 U$10.1 | 18,30 D1.1 | v27.62,30.25 27.44,30.44 | v29.62,55.88 29.62,56.38 30.25,57 30.25,57.12 | v54.12,60.38 v56.12,60.38 | 9.5,60.5 9,60.5 R30.1 | 9.5,60.5 10.5,60.5 | 10.5,60.5 12,60.5 R35.1 | 9.5,60.5 v7.5,62.5 6,64 U4.2 | v10,48 10,46.5 U3.8 | 10.5,60.5 v10.5,60 | 18,30 16.9,30 v15.4,31.5 | v15.2,33.33 13.02,33.33 12.85,33.16 10.39,33.16 R36.2 | R37.2 28.05,39.1 v28.25,39.3
  Bottom 0.254: v83.75,34.62 83.75,28.12 v83.62,28 | 63.38,60.75 63.38,61.25 R7.2 | 63.38,60.75 75.5,48.62 76.5,48.62 80.19,44.94 | 80.19,44.94 83.75,41.38 v83.75,34.62 | 80.19,44.94 v81,45.75 | v81.75,34.38 83.62,34.38 v83.75,34.62 | v63.25,42.38 64.88,42.38 69.5,37.75 v69.5,37.62 | 43.25,71.38 38.5,71.38 | 38.5,71.38 38.12,71.38 v32.62,65.88 | v48.12,71.38 43.25,71.38 | C8.2 46.5,28.12 40.5,28.12 C9.2 40.38,28.25 34.75,28.25 C10.2 34.62,28.12 29.38,28.12 C11.2 29.25,28.12 28.5,28.88 28.5,29.12 27.44,30.19 | 27.44,30.19 24.75,32.88 24.75,34.25 28.25,37.75 v28.25,39.3 28.25,46 29,46.75 29.62,46.75 v29.62,55.88 | v27.62,30.25 27.5,30.25 27.44,30.19 | 63.38,60.75 62.62,60.75 62.25,60.38 v56.12,60.38 | v54.12,60.38 43.25,71.25 43.25,71.38 | v10,48 10.5,48.5 v10.5,60 | v7.5,62.5 7.5,68.5 12.5,73.5 38,73.5 38,72 38.5,71.5 38.5,71.38 | v15.4,31.5 15.4,33.13 v15.2,33.33
N$1  (via drill 0.61)
  Top 0.254: R26.1 35.5,50.5 32,50.5 C35.1 31.5,50 v31.5,49 | v19,46.5 20,45.5 R10.2 20.5,45 21.5,44 v21.5,43 | v12.5,44.5 11.5,45.5 11.5,46 11,46 U3.7 | v29.5,41.5 29,41 v27,41
  Bottom 0.254: v19,46.5 17,44.5 v12.5,44.5 | v31.5,49 30.5,48 30.5,42.5 v29.5,41.5 | v27,41 21.5,41 v21.5,43
N$2  (via drill 0.61)
  Top 0.254: v55.25,50.62 63,50.62 64.75,48.88 64.75,47.88 64,47.12 64,46.88 D2.A | v45.62,26.25 45.62,22.75 49.5,18.88 52.62,18.88 54.25,20.5 54.25,24.62 55.38,25.75 v55.38,27.38
  Bottom 0.254: v55.25,50.62 51.25,46.62 51.25,31.38 47.12,27.25 46.62,27.25 v45.62,26.25 | v55.38,27.38 55.38,31 55.62,31.25 R4.1
N$3  (via drill 0.4 pad 0.1)
  Top 0.204: v79.6,24.6 81,26 v81,31.8 | v80.9,38.1 80.25,38.75 U$5.31
  Bottom 0.204: C17.1 v79.6,24.6 | v81,31.8 80.9,31.9 v80.9,38.1
N$4  (via drill 0.61)
  Top 0.254: v90.62,23.88 v86.5,19.75
  Bottom 0.254: v86.5,19.75 79.88,13.12 63,13.12 57.75,18.38 55.62,18.38 54.38,17.12 53.75,17.12 J1.2 | v90.62,23.88 90.62,36.88 91,37.25 U$19.B+
N$5  (via drill 0.4 pad 0.1)
  Top 0.204: v83,23.3 82.41,23.89 79.31,23.89 78.89,24.31 78.89,24.89 80.29,26.29 v80.29,30.9 | v62.89,47.1 60.69,49.3 v57.8,49.3 | v56.02,45.09 56.02,46.28 55.29,47.01 55.29,48.6 54.9,48.99 v54.9,49.2 | v63.85,43.55 64.45,42.95 U$5.47
  Bottom 0.204: C16.1 84.16,23.3 v83,23.3 | v80.29,30.9 80.29,37.71 80.19,37.81 80.19,38.39 80.5,38.7 80.5,42.5 75.9,47.1 v62.89,47.1 | v57.8,49.3 57.7,49.2 v54.9,49.2 | v56.02,45.09 57.01,44.1 58.1,44.1 58.3,43.9 60.1,43.9 60.45,43.55 v63.85,43.55
N$6  (via drill 0.61)
  Top 0.254: v24.62,28.88 22.88,28.88 22.12,29.62 C6.2 | v24.62,26.88 24.62,25 23.38,23.75 IC2.4
  Bottom 0.254: v24.62,26.88 v24.62,28.88
N$7
  Top 0.254: D1.2 18,23.75 17.88,23.62 C7.2 18.12,23.75 21.38,23.75 IC2.5
N$8  (via drill 0.61)
  Top 0.254: v23.5,48 24,48 24.5,47.5 R25.2 | v22.5,42 22,41.5 20.5,41.5 18.5,43.5 18.5,44 17.5,45 14.5,45 13.5,46 U3.5
  Bottom 0.254: v23.5,48 23.5,43 v22.5,42
N$9  (via drill 0.61)
  Top 0.254: v38.38,57.75 U2.12
  Bottom 0.254: 38.38,57.88 42.38,57.88 R47.1 | 38.38,57.88 36.5,59.75 36.5,60.25 37.75,61.5 42.38,61.5 R48.2 | v38.38,57.75 38.38,57.88
N$10
  Bottom 0.254: J2.2 53.62,12.75 52.88,12.75 47.62,7.5 27.12,7.5 16.75,17.88 12.38,17.88 6.75,23.5 6.75,37.25 U$19.B-
N$11  (via drill 0.61)
  Top 0.254: v84,51.38 v84,54.38 84,58.12 82.75,59.38 82.75,61.5 U$18.P$14
  Bottom 0.254: v84,51.38 82.25,51.38 C1.2 | v84,54.38 82.75,54.38 R38.2
N$12  (via drill 0.61)
  Top 0.254: v73.75,58.25 74.88,59.38 74.88,61.5 U$18.P$3
  Bottom 0.254: v73.75,58.25 73.75,54.38 C2.1
N$13
  Top 0.204: U1.D-1 7.5,27.45 R14.2
N$14
  Top 0.254: R10.1 20,44 18,46 17.5,46 R2.1 17,46.5 16,47.5 13,47.5 12.5,47 12.5,46.5 U3.6
N$15  (via drill 3)
  other vias: 95.1,95.5
N$16  (via drill 3)
  other vias: 3.3,95.1
N$17  (via drill 3)
  other vias: 95.1,3.6
N$18  (via drill 3)
  other vias: 3.1,3.3
N$19
  Top 0.254: R12.2 13,37.5 14.5,37.5 R11.1
N$20  (via drill 0.61)
  Top 0.254: 14.5,39.5 16,38 R11.2 | 14.5,39.5 12,39.5 11.5,40 11.5,40.5 11,40.5 U3.2 | v6,57.5 5,58.5 5,59 4,60 R16.1 | 14.5,39.5 v15,40
  Bottom 0.254: v6,57.5 9,54.5 9,46 v15,40
N$21  (via drill 0.61)
  Top 0.254: 44.05,41.05 43.7,41.4 43.7,41.8 45.58,43.69 45.58,43.9 49.65,43.9 R17.2 | 44.05,41.05 44.6,40.5 45.66,40.5 C33.2 | U3.1 9.5,40.5 10.5,39.5 10.5,38 R12.1 11,37.5 14,34.5 v14.5,34.5 | v26,34 v24.5,35.5 | 44.05,41.05 v43.5,40.5
  Bottom 0.254: v14.5,34.5 24,34.5 24,35 v24.5,35.5 | v26,34 26.5,34.5 26.5,35 32,40.5 v43.5,40.5
N$22
  Top 0.254: 4.5,39 7.5,42 11.5,42 12,41.5 12,41 12.5,41 U3.3 | 4.5,39 3,37.5 R32.1 | 4.5,39 2,41.5 2,44.5 3,45.5 3,46.5 R13.1
N$23
  Top 0.204: U1.D+1 8.05,26.8 R15.2
N$24  (via drill 0.6)
  Top 0.254: 15.5,58.9 15.5,56.5 13,54 12.5,54 U$1.2 | 15.5,58.9 15.5,60.5 14,62 14,65.5 R29.2 | R37.1 25.3,39.15 v25.3,42.4 | v23.6,52.9 21.8,52.9 v21.4,52.5 | v16.7,58.9 15.5,58.9
  Bottom 0.254: v23.6,52.9 23.6,49.09 24.34,48.35 24.34,43.36 v25.3,42.4 | v21.4,52.5 20.9,52.5 20.7,52.7 20.7,54.9 v16.7,58.9
N$25
  Top 0.254: C31.2 49.75,48.5 50.75,47.5 50.75,43 R17.1 47.12,39.38 47.12,35.62 R18.2
N$26  (via drill 0.61)
  Top 0.254: v23.5,59.75 20.5,62.75 C30.2 | v32.38,57.25 32.12,57.25 31.62,57.75 U2.3 | v45.25,37.62 45.25,35.62 R18.1
  Bottom 0.254: v23.5,59.75 23.75,59.75 26.25,57.25 v32.38,57.25 32.38,57.12 42.25,47.25 42.25,43.38 45.25,40.38 v45.25,37.62
N$27  (via drill 0.61)
  Top 0.254: v41.38,43.25 41.38,40.38 C32.1 | v32.88,55.25 31.75,56.38 31,56.38 U2.5 | v23.75,54.5 R22.1
  Bottom 0.254: v41.38,43.25 41.38,46.75 v32.88,55.25 32.75,55.25 31.25,56.75 29.25,56.75 27,54.5 v23.75,54.5
N$28  (via drill 0.61)
  Top 0.254: R20.1 20.62,58.88 23.88,58.88 24.75,59.75 R19.2 24.88,59.88 v26.25,58.5 | v32.38,58.5 31,58.5 U2.2
  Bottom 0.254: v26.25,58.5 v32.38,58.5
N$29  (via drill 0.61)
  Top 0.254: C33.1 45.88,38.75 41.5,38.75 C32.2 41.38,38.62 41.25,38.5 36.38,38.5 32.25,42.62 v27.38,42.62 | v24.88,52.75 24.88,55.5 R21.2
  Bottom 0.254: v24.88,52.75 24.88,45.12 v27.38,42.62
N$30
  Top 0.254: R25.1 26.5,47.38 26.5,47.88 26.88,48.25 26.88,51.12 26.5,51.5 R24.1 26.5,51.62 26.5,55 | 26.5,55 26.5,55.5 R21.1 | 26.5,55 30.88,55 U2.7
N$31  (via drill 0.61)
  Top 0.254: R23.1 20.75,50.5 23.75,50.5 R24.2 24.75,51.38 v25.88,50.25 | v27.75,50.5 32,54.75 32,55.38 31.62,55.75 31,55.75 U2.6
  Bottom 0.254: v27.75,50.5 26.12,50.5 v25.88,50.25
N$32
  Top 0.254: R29.1 12,66 12,69 7.5,69 5,66.5 U4.3
N$33
  Top 0.254: 39.88,57 38.88,57 38.38,56.5 36.88,56.5 U2.10 | 39.88,57 C34.1 | R26.2 37.25,54.25 39.88,56.88 39.88,57
N$34
  Top 0.254: R32.2 7,37.5 R33.1
N$35  (via drill 0.61)
  Top 0.254: R28.1 48.25,52.5 48.12,52.38 42.62,52.38 R27.2 42.5,52.38 v39,52.38 | v35.5,55.88 36.75,55.88 U2.9
  Bottom 0.254: v39,52.38 v35.5,55.88
N$36  (via drill 0.6, 0.61)
  Top 0.254: v3.5,44.5 3.5,43 R31.1 | v6,59 7,60 R30.2 7,60.5 4.5,63 4.5,64 U4.1 | R36.1 5.18,36.67 2.26,36.67 1.54,37.39 1.54,49.38 v1.52,49.4
  Bottom 0.254: v3.5,44.5 5,46 5,49.3 | 5,49.3 5,58 v6,59 | v1.52,49.4 4.9,49.4 5,49.3
N$37  (via drill 0.61)
  Top 0.254: v12.5,34 9,37.5 R33.2 | v18.5,40 17,41.5 R34.1 17,42 v16,42 | v14.5,59 14.5,60 R35.2
  Bottom 0.254: v18.5,40 v12.5,34 | v14.5,59 20,53.5 20,46 v16,42
N$39  (via drill 0.61)
  Top 0.254: v78.25,57.5 76.38,59.38 76.38,61.5 U$18.P$5
  Bottom 0.254: v78.25,57.5 78.25,54.5 C36.1
N$40  (via drill 0.61)
  Top 0.254: v72.25,58 73.38,59.12 73.88,59.12 74.25,59.5 U$18.P$2
  Bottom 0.254: v72.25,58 72.25,54.38 C2.2
N$41  (via drill 0.61)
  Top 0.254: v76.75,57.75 76.75,58.25 75.75,59.25 75.75,61.5 U$18.P$4
  Bottom 0.254: v76.75,57.75 76.75,54.5 C36.2
N$42  (via drill 0.61)
  Top 0.254: v89.75,64.25 90.38,64.25 91,63.62 91,61.5 U$18.P$26
  Bottom 0.254: v89.75,64.25 89.75,54.25 R39.1
N$43  (via drill 0.61)
  Top 0.254: v91.25,58.75 91.25,59 91.75,59.5 U$18.P$27
  Bottom 0.254: v91.25,58.75 92,58 92,54.25 C3.2
N$44  (via drill 0.61)
  Top 0.254: v93.12,64.25 92.5,63.62 92.5,61.5 U$18.P$28
  Bottom 0.254: v93.12,64.25 94.88,62.5 94.88,54.25 C37.2
N$45
  Top 0.204: U1.ID1 6.85,26.15 7.4,25.6 7.4,24.85 R43.2
N$46
  Top 0.204: U1.VBUS1 6.4,28.1 6.8,28.5 6.8,31.05 U$15.1
N$47
  Top 0.254: U$15.2 9.25,31.62 11.12,31.62 R42.2
N$48  (via drill 0.61)
  Top 0.254: v57.75,47 60,47 D3.A | v47,26.38 46.12,25.5 46.12,23 49.75,19.38 52.38,19.38 53.75,20.75 53.75,25.38 v54.5,26.12
  Bottom 0.254: v57.75,47 57.38,47 56.25,48.12 53.62,48.12 51.75,46.25 51.75,31.12 v47,26.38 | v54.5,26.12 54.5,36.12 55.75,37.38 R46.1
N$58
  Top 0.254: U$6.2 30.12,10.5 30.12,8.12 29.12,7.12 R62.2
N$59
  Top 0.254: U$6.7 30.12,15.88 30.12,18 29,19.12 R63.1
N$60
  Top 0.254: U$6.6 31.5,15.88 31.5,18.75 31.88,19.12 R64.1
N$61
  Top 0.254: D6.C 27.25,23.62 27.25,19.25 R63.2
N$62
  Top 0.254: D5.C 33.75,23.62 33.75,19.25 R64.2
N$65  (via drill 0.61)
  Top 0.254: U$7.5 39.25,19.62 39.25,15.25 38.38,14.38 C40.1 38.25,14.25 v38.25,12.25 | v34.38,8.38 34.62,8.12 34.62,7.12 R65.1
  Bottom 0.254: v38.25,12.25 v34.38,8.38
N$67
  Top 0.254: U$7.1 40.25,21.88 40.25,20.75 44.5,16.5 44.5,15.5 46.25,13.75 46.25,13.25 T1.4
N$68
  Top 0.254: R66.2 37.38,10.62 37.38,22 38,22.62 38.62,22.62 39.25,22 U$7.2
N$69  (via drill 0.61)
  Top 0.254: v43.5,14 44.25,13.25 T1.1 | v45.38,15.88 45.38,17.5 44.38,18.5 44.38,18.88 T1.8
  Bottom 0.254: v45.38,15.88 v43.5,14
N$70  (via drill 0.61)
  Top 0.254: v39.38,20.88 38.38,21.88 U$7.3 | v44.75,20.88 46.25,19.38 46.25,19 T1.5
  Bottom 0.254: v44.75,20.88 v39.38,20.88
NRST  (via drill 0.4 pad 0.1, 0.61)
  Top 0.204: C22.1 55.07,53.31 54.09,52.33 54.09,47.31 55.31,46.09 55.31,41.16 52.5,38.35 52.5,28.7 52.99,28.21 v59.2,28.21 | v66,33.19 66.95,32.24 U$5.7
  Top 0.254: v60.38,61.25 60.38,57.12 60.12,56.88 S1.1 | S1.2 65.12,56.88 60.25,56.88 S1.1 | S1.1 60,56.75 55.62,56.75 55,56.12 55,53.38 55.07,53.31
  Bottom 0.204: v59.2,28.21 64.18,33.19 v66,33.19
  Bottom 0.254: v60.38,61.25 61.62,61.25 R7.1
OSC32_IN
  Top 0.204: U$5.3 64.95,26.95 64.3,26.3 60.5,26.3 60.3,26.1 60.3,23.7 U$8.1
  Top 0.254: C21.2 60.38,20.75 60.38,23.5 U$8.1
OSC32_OUT
  Top 0.204: U$5.4 65.45,26.85 64.6,26 64.6,24.9 U$8.2
  Top 0.254: C20.2 63.25,20.75 63.25,23.5 U$8.2
OSC_IN
  Top 0.204: U$5.5 65.95,26.95 66.5,26.4 69.1,26.4 69.4,26.1 69.4,23.6 U$9.1
  Top 0.254: C19.2 69.62,20.5 69.62,23.25 U$9.1
OSC_OUT
  Top 0.204: U$5.6 66.45,27.03 66.64,26.84 72.76,26.84 73.3,26.3 73.3,23.4 U$9.2
  Top 0.254: C18.2 73.75,20.62 73.75,23 73.5,23.25 U$9.2
OTG_FS_DM  (via drill 0.4 pad 0.1)
  Top 0.204: R14.1 11.7,28.8 v11.8,28.9 | v50.7,28 50.7,37.7 53.8,40.8 v53.8,46.6 | U$5.44 66,41.24 66,41.93 66,45.1 63.69,45.1 63.3,44.71 62.29,44.71 v62,45
  Bottom 0.204: v11.8,28.9 21.5,28.9 24.3,31.7 25.3,31.7 26.7,30.3 26.7,27.1 29.3,24.5 47.2,24.5 v50.7,28 | v53.8,46.6 55.7,46.6 55.71,46.59 56.11,46.59 57.4,45.3 61.7,45.3 v62,45
OTG_FS_DP  (via drill 0.4 pad 0.1)
  Top 0.204: R15.1 v11.9,26 | v52,28.1 52,38.42 54.51,40.93 54.51,45.71 v54.6,45.8 | v61,44.3 61.7,44.3 61.71,44.29 62.29,44.29 62.3,44.3 65.59,44.3 65.59,42.1 65.5,42 65.5,41.24 U$5.45
  Bottom 0.204: v11.9,26 27.1,26 29.39,23.71 47.61,23.71 v52,28.1 | v54.6,45.8 56.32,45.8 57.23,44.89 60.41,44.89 v61,44.3
OTG_FS_ID  (via drill 0.4 pad 0.1)
  Top 0.204: R43.1 12.3,23.4 v12.4,23.3 | v56,47.3 56.2,47.3 57.7,45.8 66.5,45.8 66.5,41.93 66.5,41.24 U$5.43
  Bottom 0.204: v12.4,23.3 48.7,23.3 52.9,27.5 52.9,46.7 53.6,47.4 55.9,47.4 v56,47.3
PWM  (via drill 0.6)
  Top 0.254: R31.2 4.85,44.25 10.2,49.6 14.1,49.6 v14.7,50.2 | v41.9,65.8 34.6,65.8 33.19,67.21 22.05,67.21 17.97,63.12 17.97,53.47 v17.1,52.6 | v57.7,53.6 57.84,53.6 59.91,51.54 75.16,51.54 v76.7,50 | v79.6,47.2 v85.2,47.2 | v90.1,42.5 85.06,42.5 84.85,42.71 78.19,42.71 75.1,45.8 68.5,45.8 68.4,45.7 68.4,41.97 68.43,41.94 68.43,41.22 U$5.39
  Bottom 0.254: v14.7,50.2 v17.1,52.6 | v57.7,53.6 49.34,61.96 49.34,63.72 47.26,65.8 v41.9,65.8 | v76.7,50 76.8,50 v79.6,47.2 | v85.2,47.2 85.2,50 86.6,51.4 89.3,51.4 91.7,49 91.7,44.1 v90.1,42.5
PWMA  (via drill 0.61)
  Top 0.254: U$5.57 61.25,35.25 v60.12,34.12 | v63,30.75 v59.25,30.75 | v54.62,73 54.12,72.5 53.25,72.5 IC1.23
  Bottom 0.254: v60.12,34.12 60.12,32.88 59.25,32 v59.25,30.75 | v63,30.75 69.38,30.75 77.5,22.62 77.5,21.12 78,20.62 93.75,20.62 95.75,22.62 95.75,62.88 85.62,73 v54.62,73
PWMB  (via drill 0.61)
  Top 0.254: U$5.61 59.75,33.25 v56.5,30 | v57.25,24.88 57.25,24 55.62,22.38 v55.62,20.75 | v48.5,63.38 52.38,67.25 53.12,67.25 IC1.15
  Bottom 0.254: v56.5,30 56.5,25.62 v57.25,24.88 | v55.62,20.75 53.12,20.75 50.75,18.38 12.62,18.38 10,21 10,32.75 22.62,45.38 22.62,60.12 26.62,64.12 47.75,64.12 v48.5,63.38
STBY  (via drill 0.61)
  Top 0.254: v72,38.25 U$5.30 | v81.38,39.62 v76.25,39.62 | v54.62,69.25 54,69.88 IC1.19
  Bottom 0.254: v72,38.25 74.88,38.25 v76.25,39.62 | v81.38,39.62 81.38,41.12 81,41.5 81,42.62 76,47.62 67.62,47.62 55,60.25 55,66.25 53.88,67.38 53.88,68.5 v54.62,69.25
SWTCK  (via drill 0.61)
  Top 0.254: U$5.49 62,40.12 v63,41.12 | v74.75,28.12 v74.75,31.38 | v78,24.5 80,22.5 83.25,22.5 86,25.25 v86,25.62
  Bottom 0.254: v63,41.12 65.38,41.12 68.62,37.88 68.62,37.25 69.12,36.75 69.38,36.75 v74.75,31.38 | v74.75,28.12 74.75,27.75 v78,24.5 | v86,25.62 87.62,25.62 90.25,23 91.25,23 92.88,24.62 JP2.3
SWTDIO  (via drill 0.4 pad 0.1)
  Top 0.204: v65.7,37.3 64.95,38.05 U$5.46
  Bottom 0.204: JP2.4 88.3,22.1 83.91,26.49 v78.4,26.49 74.99,29.9 73.9,29.9 66.5,37.3 v65.7,37.3
VBUS  (via drill 0.4 pad 0.1, 0.61)
  Top 0.204: D5.A 32.3,23.78 v32.3,25.3 | v46.91,25.21 47.69,24.42 47.69,22.11 49.91,19.89 52.19,19.89 53.31,21.01 53.31,25.49 53.26,25.54 v53.26,25.96 | v53.61,38.45 56.1,40.95 v56.1,43.1 | v64.2,36 64.3,35.9 v69.1,35.9 | v66.9,38.5 66.95,38.55 U$5.42
  Top 0.254: 29,15 29,14.38 32.75,10.62 U$6.4 | 29,15 29,15.75 U$6.8 | 30.88,23.75 32.25,23.75 D5.A | 30.88,23.75 28.88,23.75 D6.A 28.75,23.75 27.38,25.12 v26.75,25.12 | v17.12,25.12 12.88,29.38 12.88,31.5 R42.1 | v10.88,21.38 10.5,21 10.5,15.25 10.62,15.12 10.62,9 12.38,7.25 12.38,5.62 C38.A | 29,15 30.62,15 30.88,15.25 30.88,23.75
  Bottom 0.204: v32.3,25.3 32.39,25.21 v46.91,25.21 | v53.26,25.96 53.61,26.31 v53.61,38.45 | v56.1,43.1 59.8,43.1 64.2,38.7 v64.2,36 | v69.1,35.9 66.9,38.1 v66.9,38.5
  Bottom 0.254: v26.75,25.12 v17.12,25.12 13.12,25.12 10.88,22.88 v10.88,21.38
VCC  (via drill 0.61)
  Top 0.254: 79.44,59.19 79.25,59.38 79.25,61.5 U$18.P$9 | 79.44,59.19 80.44,58.19 | 80.44,58.19 v80.88,57.75 80.88,53.25 85.88,48.25 86.25,48.25 92.88,41.62 92.88,29.75 JP2.1 | 79.44,59.19 79.38,59.12 77.38,59.12 77.12,59.38 77.12,61.5 U$18.P$6 77,61.62 77,63.62 72.38,68.25 57.62,68.25 57.56,68.31 | U$18.P$11 80.5,61.5 80.5,58.25 80.44,58.19 | 23.19,21.94 23.25,21.88 23.25,21.38 IC2.3 | 23.19,21.94 22.75,22.38 22,22.38 21.5,21.88 21.5,21.38 IC2.1 21.38,21.25 v20.38,21.25 | SW1.CH1A 17.12,13.12 21.38,17.38 21.38,18.12 C5.2 21.38,18.25 v20.38,19.25 | 57.56,68.31 59.25,70 59.25,73.25 60.38,74.38 JP1.1 | 57.56,68.31 51.19,61.94 | 51.19,61.94 v47.12,57.88 | 23.19,21.94 25.88,24.62 25.88,25.5 35.12,34.75 47.75,34.75 50.25,37.25 50.25,40.88 51.25,41.88 51.25,61.88 51.19,61.94
  Bottom 0.254: v80.88,57.75 80.88,54.5 R38.1 | v20.38,19.25 v20.38,21.25 | v47.12,57.88 44.25,57.88 R47.2
VDDA  (via drill 0.4 pad 0.1, 0.61)
  Top 0.204: U$5.13 69.91,29.75 69.91,29.07 69.73,28.89 69.6,28.89 v69.21,28.5 | v65.79,23.01 v65.8,23 65.8,18.3 63.4,15.9 59.4,15.9 57.6,17.7 v57.6,23.3 | v52.6,25.2 51.9,24.5 v51.9,20.6 | v48.4,22.4 48.2,22.6 v48.2,33.7
  Top 0.254: U$10.2 27.5,33.75 v28,34.25
  Bottom 0.204: v65.79,23.01 65.79,27.98 66.86,29.05 67.45,29.05 68,28.5 v69.21,28.5 | v57.6,23.3 55.7,25.2 v52.6,25.2 | v51.9,20.6 51.51,20.99 50.61,20.99 49.2,22.4 v48.4,22.4 | v48.2,33.7 47.76,34.14 C12.2
  Bottom 0.254: C12.2 46,34.25 C13.2 40.38,34.25 34.62,34.25 C14.2 29,34.25 C15.2 29.12,34.5 28.88,34.25 v28,34.25
VM
  Top 0.254: IC1.13 53.25,66 53.25,66.3 IC1.14 | 60.5,72 JP1.2
  Top 0.406: 53.25,66.3 54.8,66.3 56.9,68.4 56.9,73.7 55.22,73.7 55,73.91 53.63,73.91 53.24,74.3 | IC1.24 53.24,73.39
  Top 1.016: 53.24,76.4 53.24,74.3 53.24,73.39 | JP1.2 65,71.9 65,76.4 | 65,76.4 53.24,76.4 | 53.24,76.4 53.24,76.45 U$13.2 49.5,80.4 49.5,81.56 | U$16.2 73.3,89.2 73.3,76.4 65,76.4

## Text on the board
tPlace: TonyGUO / 20190824 | Blood Pressure Monitor / Oscillometric Method / v2.0